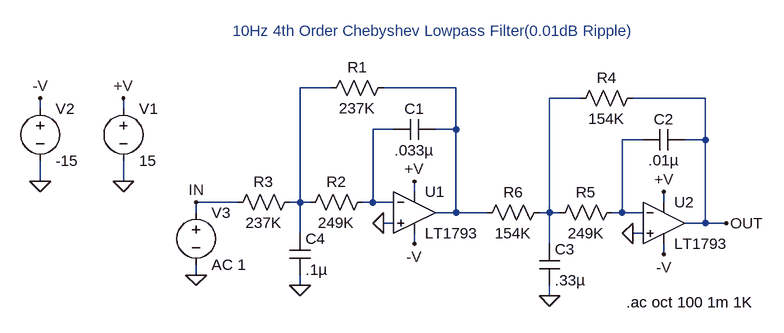
[diagram p0: schematic 1793.asc]
1793.asc, the LTspice schematic file:
Version 4
SHEET 1 908 680
WIRE 224 48 176 48
WIRE 416 48 304 48
WIRE 608 64 560 64
WIRE 800 64 688 64
WIRE -224 80 -224 64
WIRE -96 80 -96 64
WIRE 320 112 288 112
WIRE 416 112 416 48
WIRE 416 112 384 112
WIRE 704 128 672 128
WIRE 800 128 800 64
WIRE 800 128 768 128
WIRE -224 192 -224 160
WIRE -96 192 -96 160
WIRE 352 208 352 192
WIRE 80 224 16 224
WIRE 176 224 176 48
WIRE 176 224 160 224
WIRE 192 224 176 224
WIRE 288 224 288 112
WIRE 288 224 272 224
WIRE 320 224 288 224
WIRE 736 224 736 208
WIRE 16 240 16 224
WIRE 416 240 416 112
WIRE 416 240 384 240
WIRE 464 240 416 240
WIRE 560 240 560 64
WIRE 560 240 544 240
WIRE 576 240 560 240
WIRE 672 240 672 128
WIRE 672 240 656 240
WIRE 704 240 672 240
WIRE 320 256 304 256
WIRE 800 256 800 128
WIRE 800 256 768 256
WIRE 832 256 800 256
WIRE 176 272 176 224
WIRE 704 272 688 272
WIRE 352 288 352 272
WIRE 560 288 560 240
WIRE 736 304 736 288
WIRE 16 336 16 320
WIRE 176 352 176 336
WIRE 560 368 560 352
FLAG -96 192 0
FLAG 352 192 +V
FLAG -96 64 +V
FLAG 352 288 -V
FLAG -224 192 0
FLAG -224 64 -V
FLAG 16 336 0
FLAG 304 256 0
FLAG 736 208 +V
FLAG 736 304 -V
FLAG 688 272 0
FLAG 832 256 OUT
FLAG 16 224 IN
FLAG 560 368 0
FLAG 176 352 0
SYMBOL voltage -96 64 R0
SYMATTR InstName V1
SYMATTR Value 15
SYMBOL voltage -224 64 R0
SYMATTR InstName V2
SYMATTR Value -15
SYMBOL voltage 16 224 R0
SYMATTR InstName V3
SYMATTR Value AC 1
SYMBOL cap 384 96 R90
WINDOW 0 0 32 VBottom 0
WINDOW 3 32 32 VTop 0
SYMATTR InstName C1
SYMATTR Value .033µ
SYMBOL res 320 32 R90
WINDOW 0 0 56 VBottom 0
WINDOW 3 32 56 VTop 0
SYMATTR InstName R1
SYMATTR Value 237K
SYMBOL res 288 208 R90
WINDOW 0 0 56 VBottom 0
WINDOW 3 32 56 VTop 0
SYMATTR InstName R2
SYMATTR Value 249K
SYMBOL res 176 208 R90
WINDOW 0 0 56 VBottom 0
WINDOW 3 32 56 VTop 0
SYMATTR InstName R3
SYMATTR Value 237K
SYMBOL cap 768 112 R90
WINDOW 0 0 32 VBottom 0
WINDOW 3 32 32 VTop 0
SYMATTR InstName C2
SYMATTR Value .01µ
SYMBOL res 704 48 R90
WINDOW 0 0 56 VBottom 0
WINDOW 3 32 56 VTop 0
SYMATTR InstName R4
SYMATTR Value 154K
SYMBOL res 672 224 R90
WINDOW 0 0 56 VBottom 0
WINDOW 3 32 56 VTop 0
SYMATTR InstName R5
SYMATTR Value 249K
SYMBOL res 560 224 R90
WINDOW 0 0 56 VBottom 0
WINDOW 3 32 56 VTop 0
SYMATTR InstName R6
SYMATTR Value 154K
SYMBOL cap 544 288 R0
SYMATTR InstName C3
SYMATTR Value .33µ
SYMBOL cap 160 272 R0
SYMATTR InstName C4
SYMATTR Value .1µ
SYMBOL opamps\\LT1793 352 176 R0
SYMATTR InstName U1
SYMBOL opamps\\LT1793 736 192 R0
SYMATTR InstName U2
TEXT 678 378 Left 0 !.ac oct 100 1m 1K
TEXT 384 -24 Bottom 0 ;10Hz 4th Order Chebyshev Lowpass Filter(0.01dB Ripple)

The netlist it stands for:
* 1793.asc
V1 +V 0 15
V2 -V 0 -15
V3 IN 0 AC 1
C1 N002 N004 .033µ
R1 N002 N001 237K
R2 N004 N001 249K
R3 N001 IN 237K
C2 OUT N005 .01µ
R4 OUT N003 154K
R5 N005 N003 249K
R6 N003 N002 154K
C3 N003 0 .33µ
C4 N001 0 .1µ
XU1 0 N004 +V -V N002 LT1793  ; pins In+ In- V+ V- OUT
XU2 0 N005 +V -V OUT LT1793  ; pins In+ In- V+ V- OUT
.ac oct 100 1m 1K
* 10Hz 4th Order Chebyshev Lowpass Filter(0.01dB Ripple)
.lib LTC.lib
.backanno
.end